# EAGLE schematic Inverter_Deko (EAGLE 9.6.2)
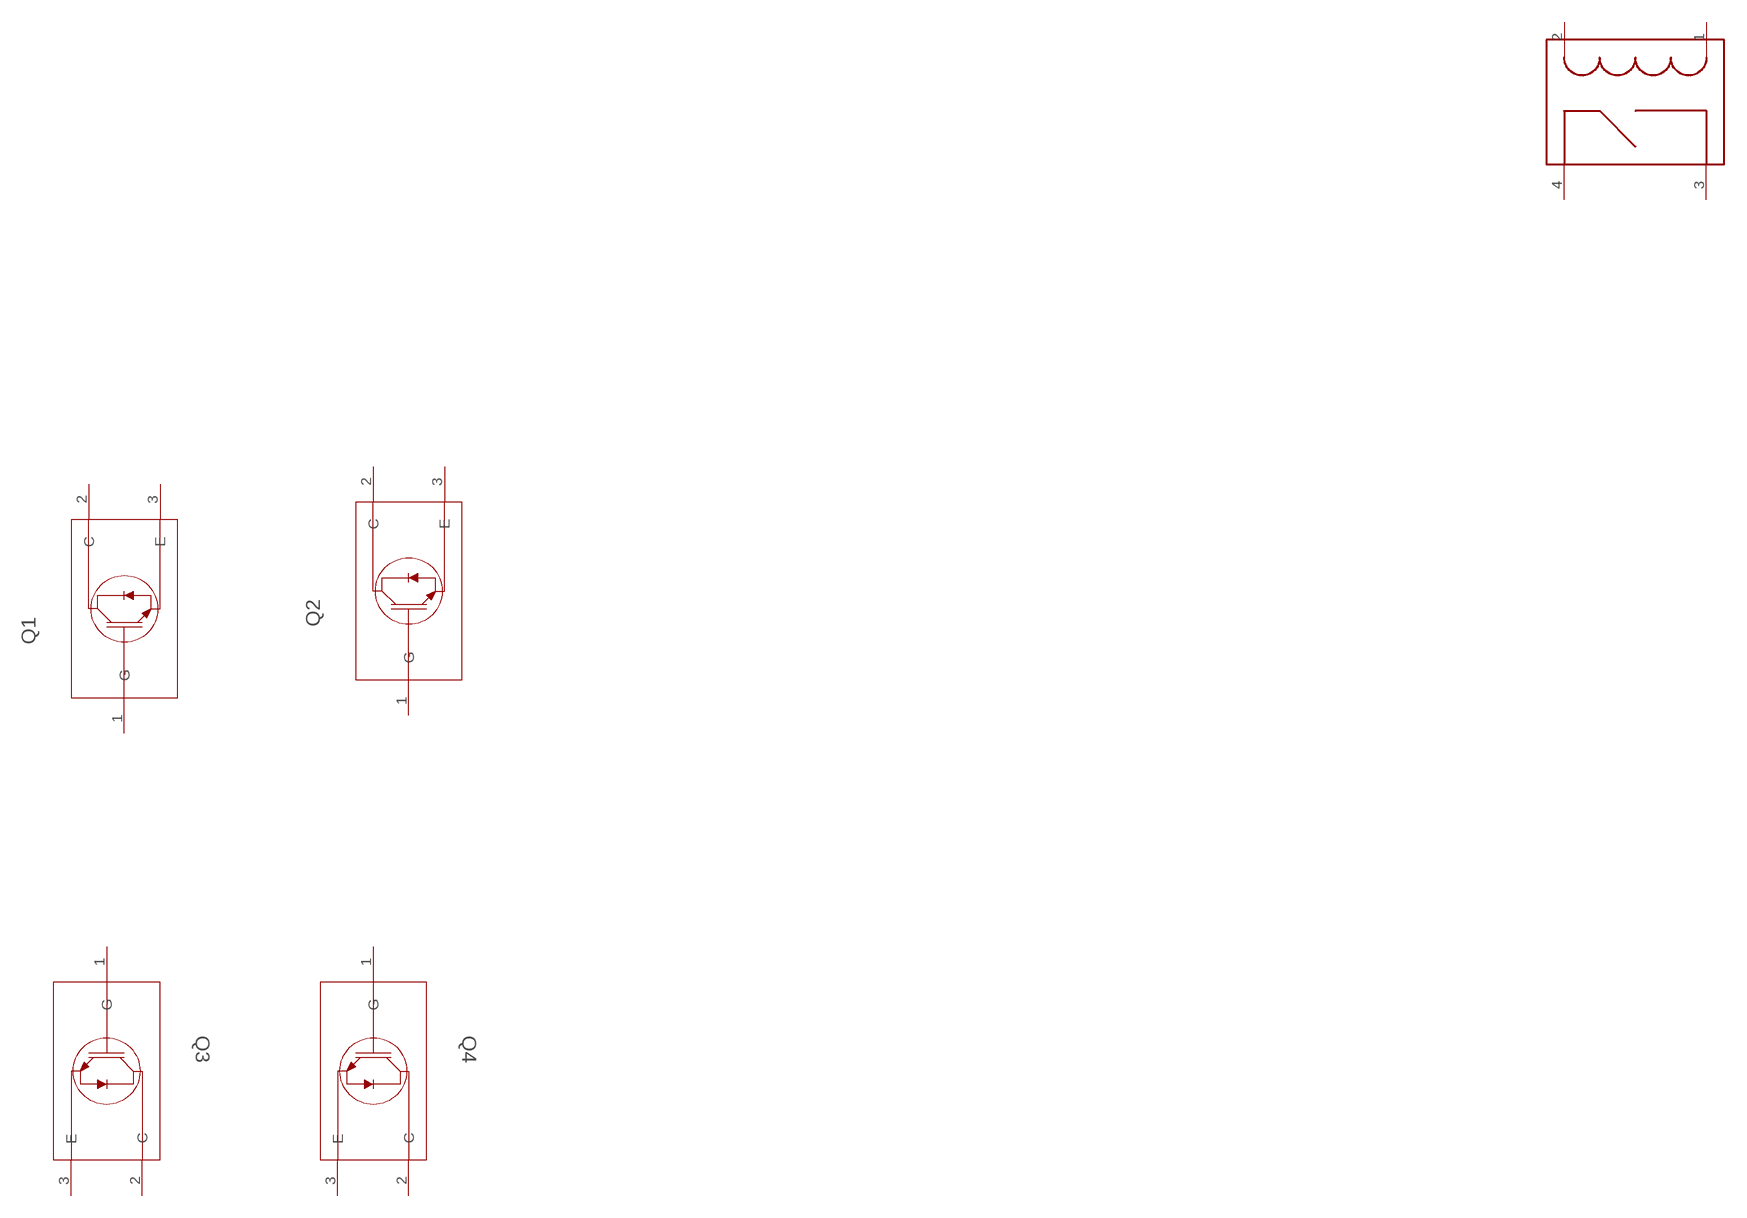
[diagram p0: schematic, sheet 1, part 1 of 2]
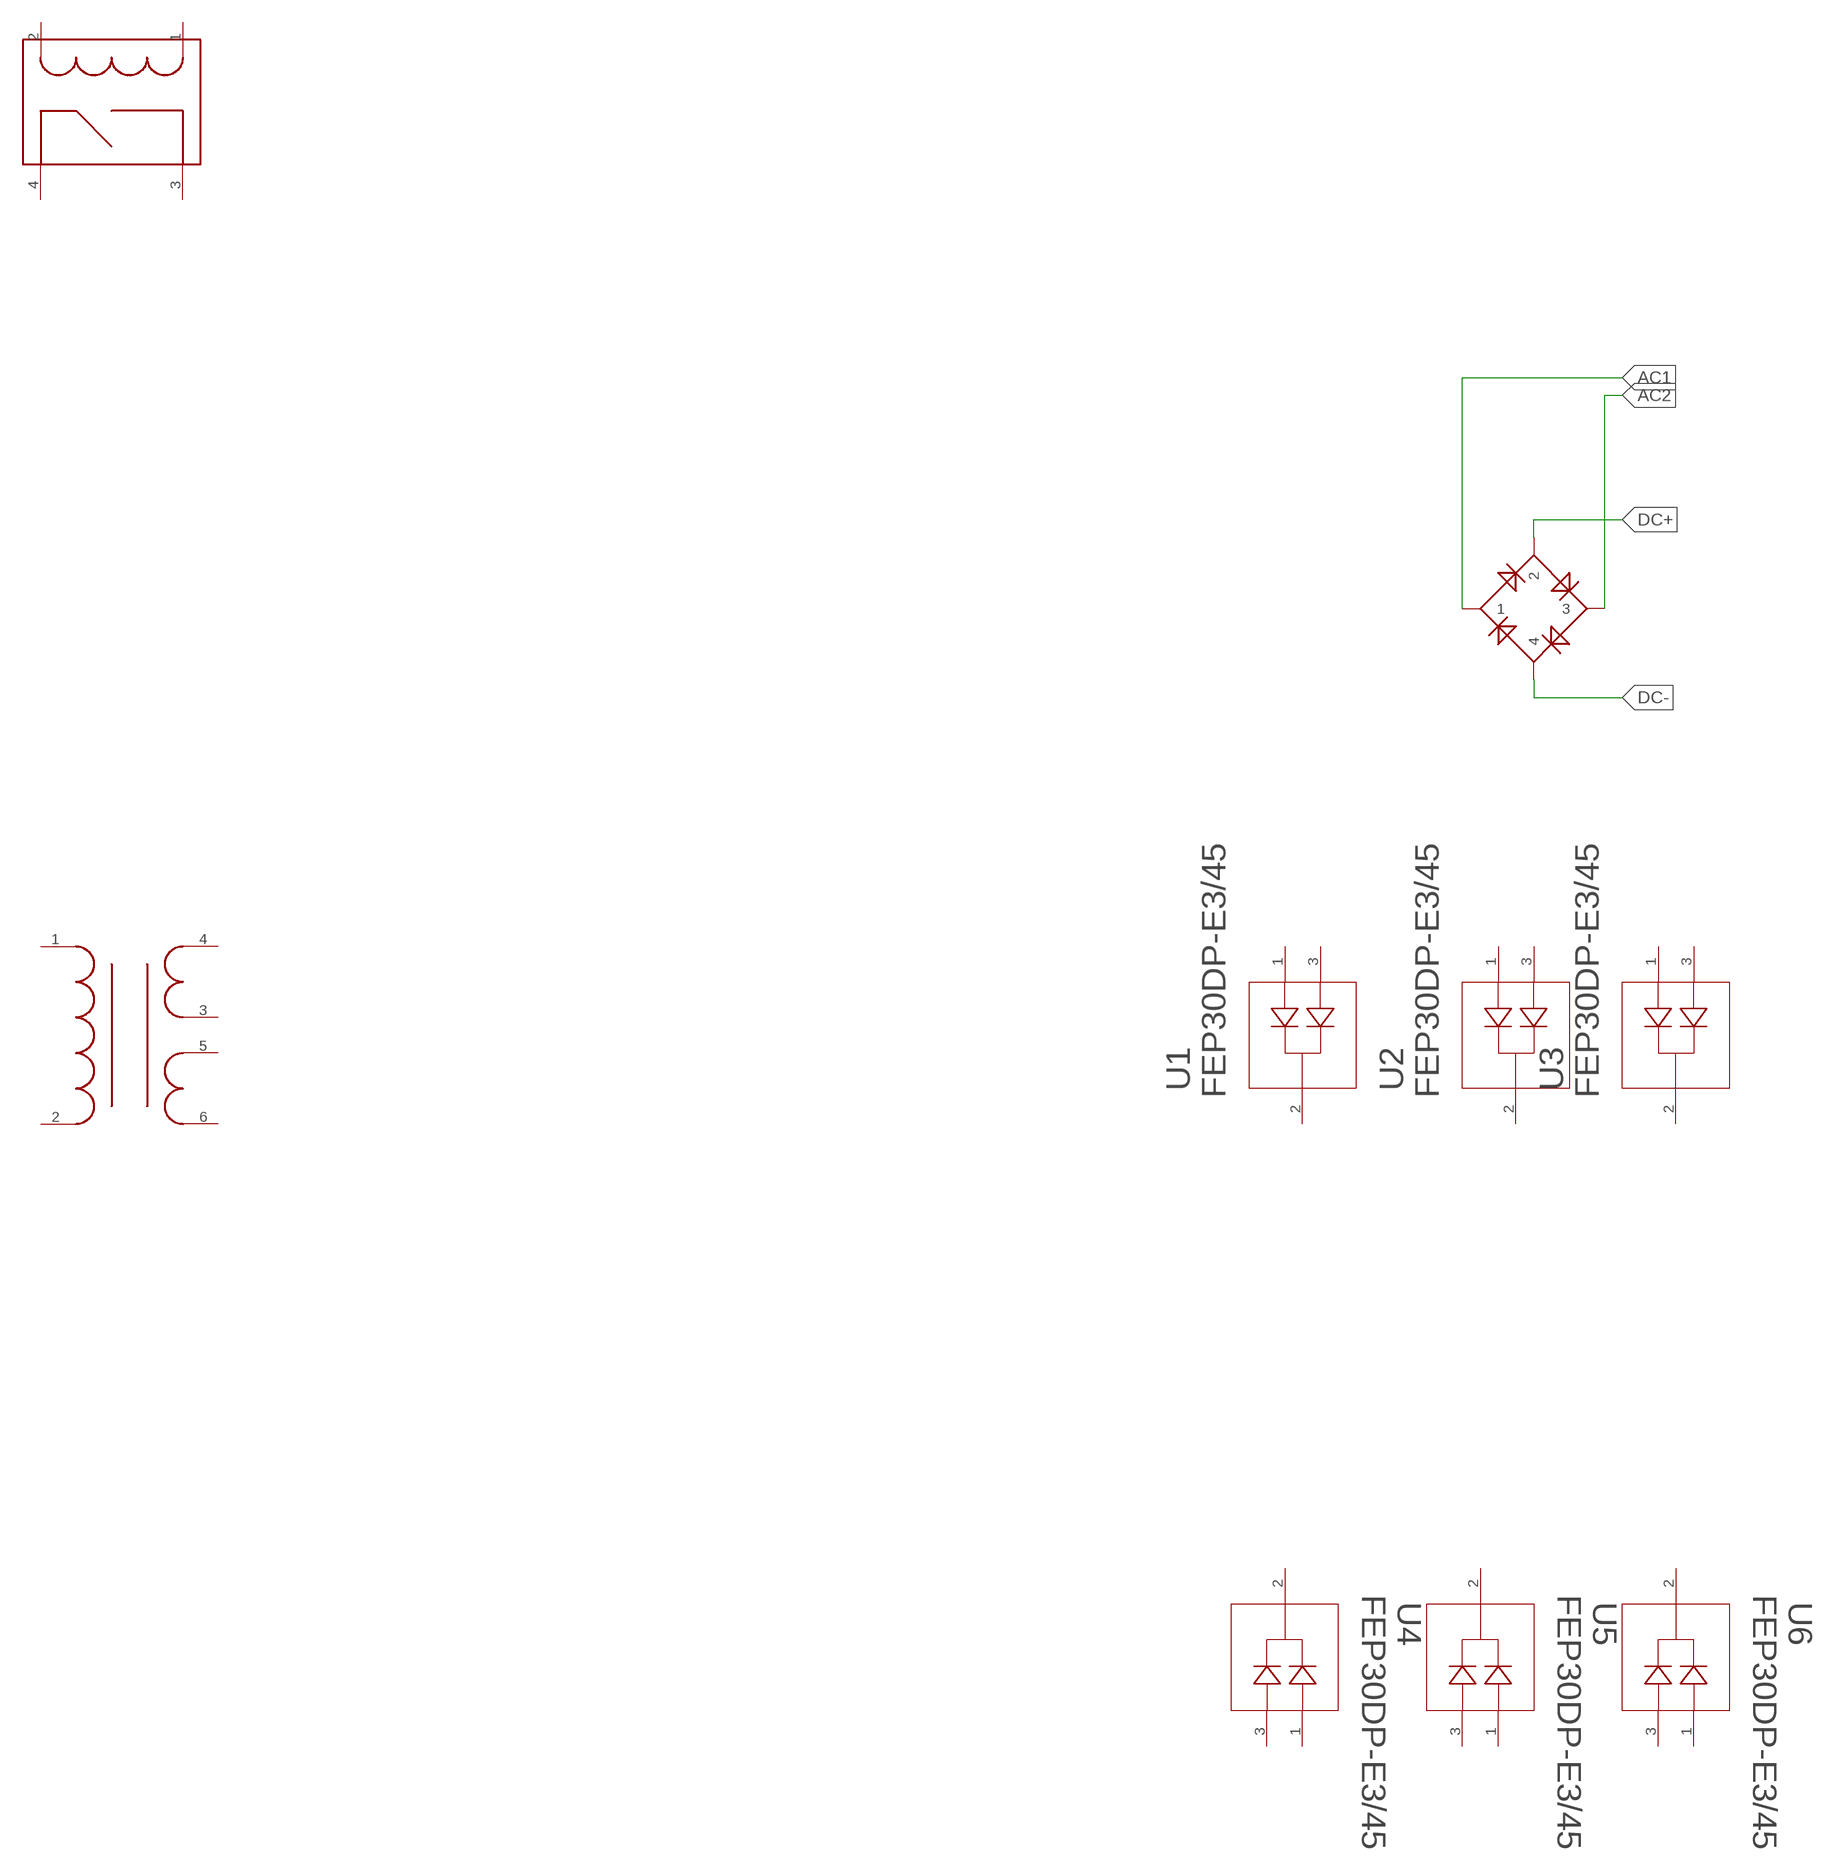
[diagram p1: schematic, sheet 1, part 2 of 2]

## Parts
Q1  IGBT_FGH60N60SFD  [TO-247_STM]
Q2  IGBT_FGH60N60SFD  [TO-247_STM]
Q3  IGBT_FGH60N60SFD  [TO-247_STM]
Q4  IGBT_FGH60N60SFD  [TO-247_STM]
U1  FEP30DP-E3/45  [TO-247AD_VIS]
U2  FEP30DP-E3/45  [TO-247AD_VIS]
U3  FEP30DP-E3/45  [TO-247AD_VIS]
U4  FEP30DP-E3/45  [TO-247AD_VIS]
U5  FEP30DP-E3/45  [TO-247AD_VIS]
U6  FEP30DP-E3/45  [TO-247AD_VIS]
U$1  KBPC5010W-G  [KBPC-W_THRU]
U$2  GENERIC_TRANSFORMER_2_X_SEC  [GENERIC_TRANSFORMER_2_X_SEC]
U$3  GENERIC_RELAY  [GENERIC_RELAY]
U$4  GENERIC_RELAY  [GENERIC_RELAY]

## Nets
AC1: U$1.1
AC2: U$1.3
DC+: U$1.2
DC-: U$1.4
Unconnected: Q1.1(G) Q1.2(C) Q1.3(E) Q2.1(G) Q2.2(C) Q2.3(E) Q3.1(G) Q3.2(C) Q3.3(E) Q4.1(G) Q4.2(C) Q4.3(E) U1.1 U1.2 U1.3 U2.1 U2.2 U2.3 U3.1 U3.2 U3.3 U4.1 U4.2 U4.3 U5.1 U5.2 U5.3 U6.1 U6.2 U6.3 U$2.1 U$2.2 U$2.3 U$2.4 U$2.5 U$2.6 U$3.1 U$3.2 U$3.3 U$3.4 U$4.1 U$4.2 U$4.3 U$4.4

## Library data of the parts
Q1-Q4 = 3D_MIG_Controller:IGBT_FGH60N60SFD
U1-U6 = 3D_MIG_Controller:FEP30DP-E3/45; BUILT_BY: EMA_UL_Team; MANUFACTURER_PART_NUMBER: FEP30DP-E3/45; SOURCELIBRARY: Vishay_2020-02-10; VENDOR: Vishay
U$1 = 3D_MIG_Controller:KBPC5010W-G
U$2 = 3D_MIG_Controller:GENERIC_TRANSFORMER_2_X_SEC
U$3 U$4 = 3D_MIG_Controller:GENERIC_RELAY